# Altium schematic sheet Power_Sheet.SchDoc (part 3 of 3)
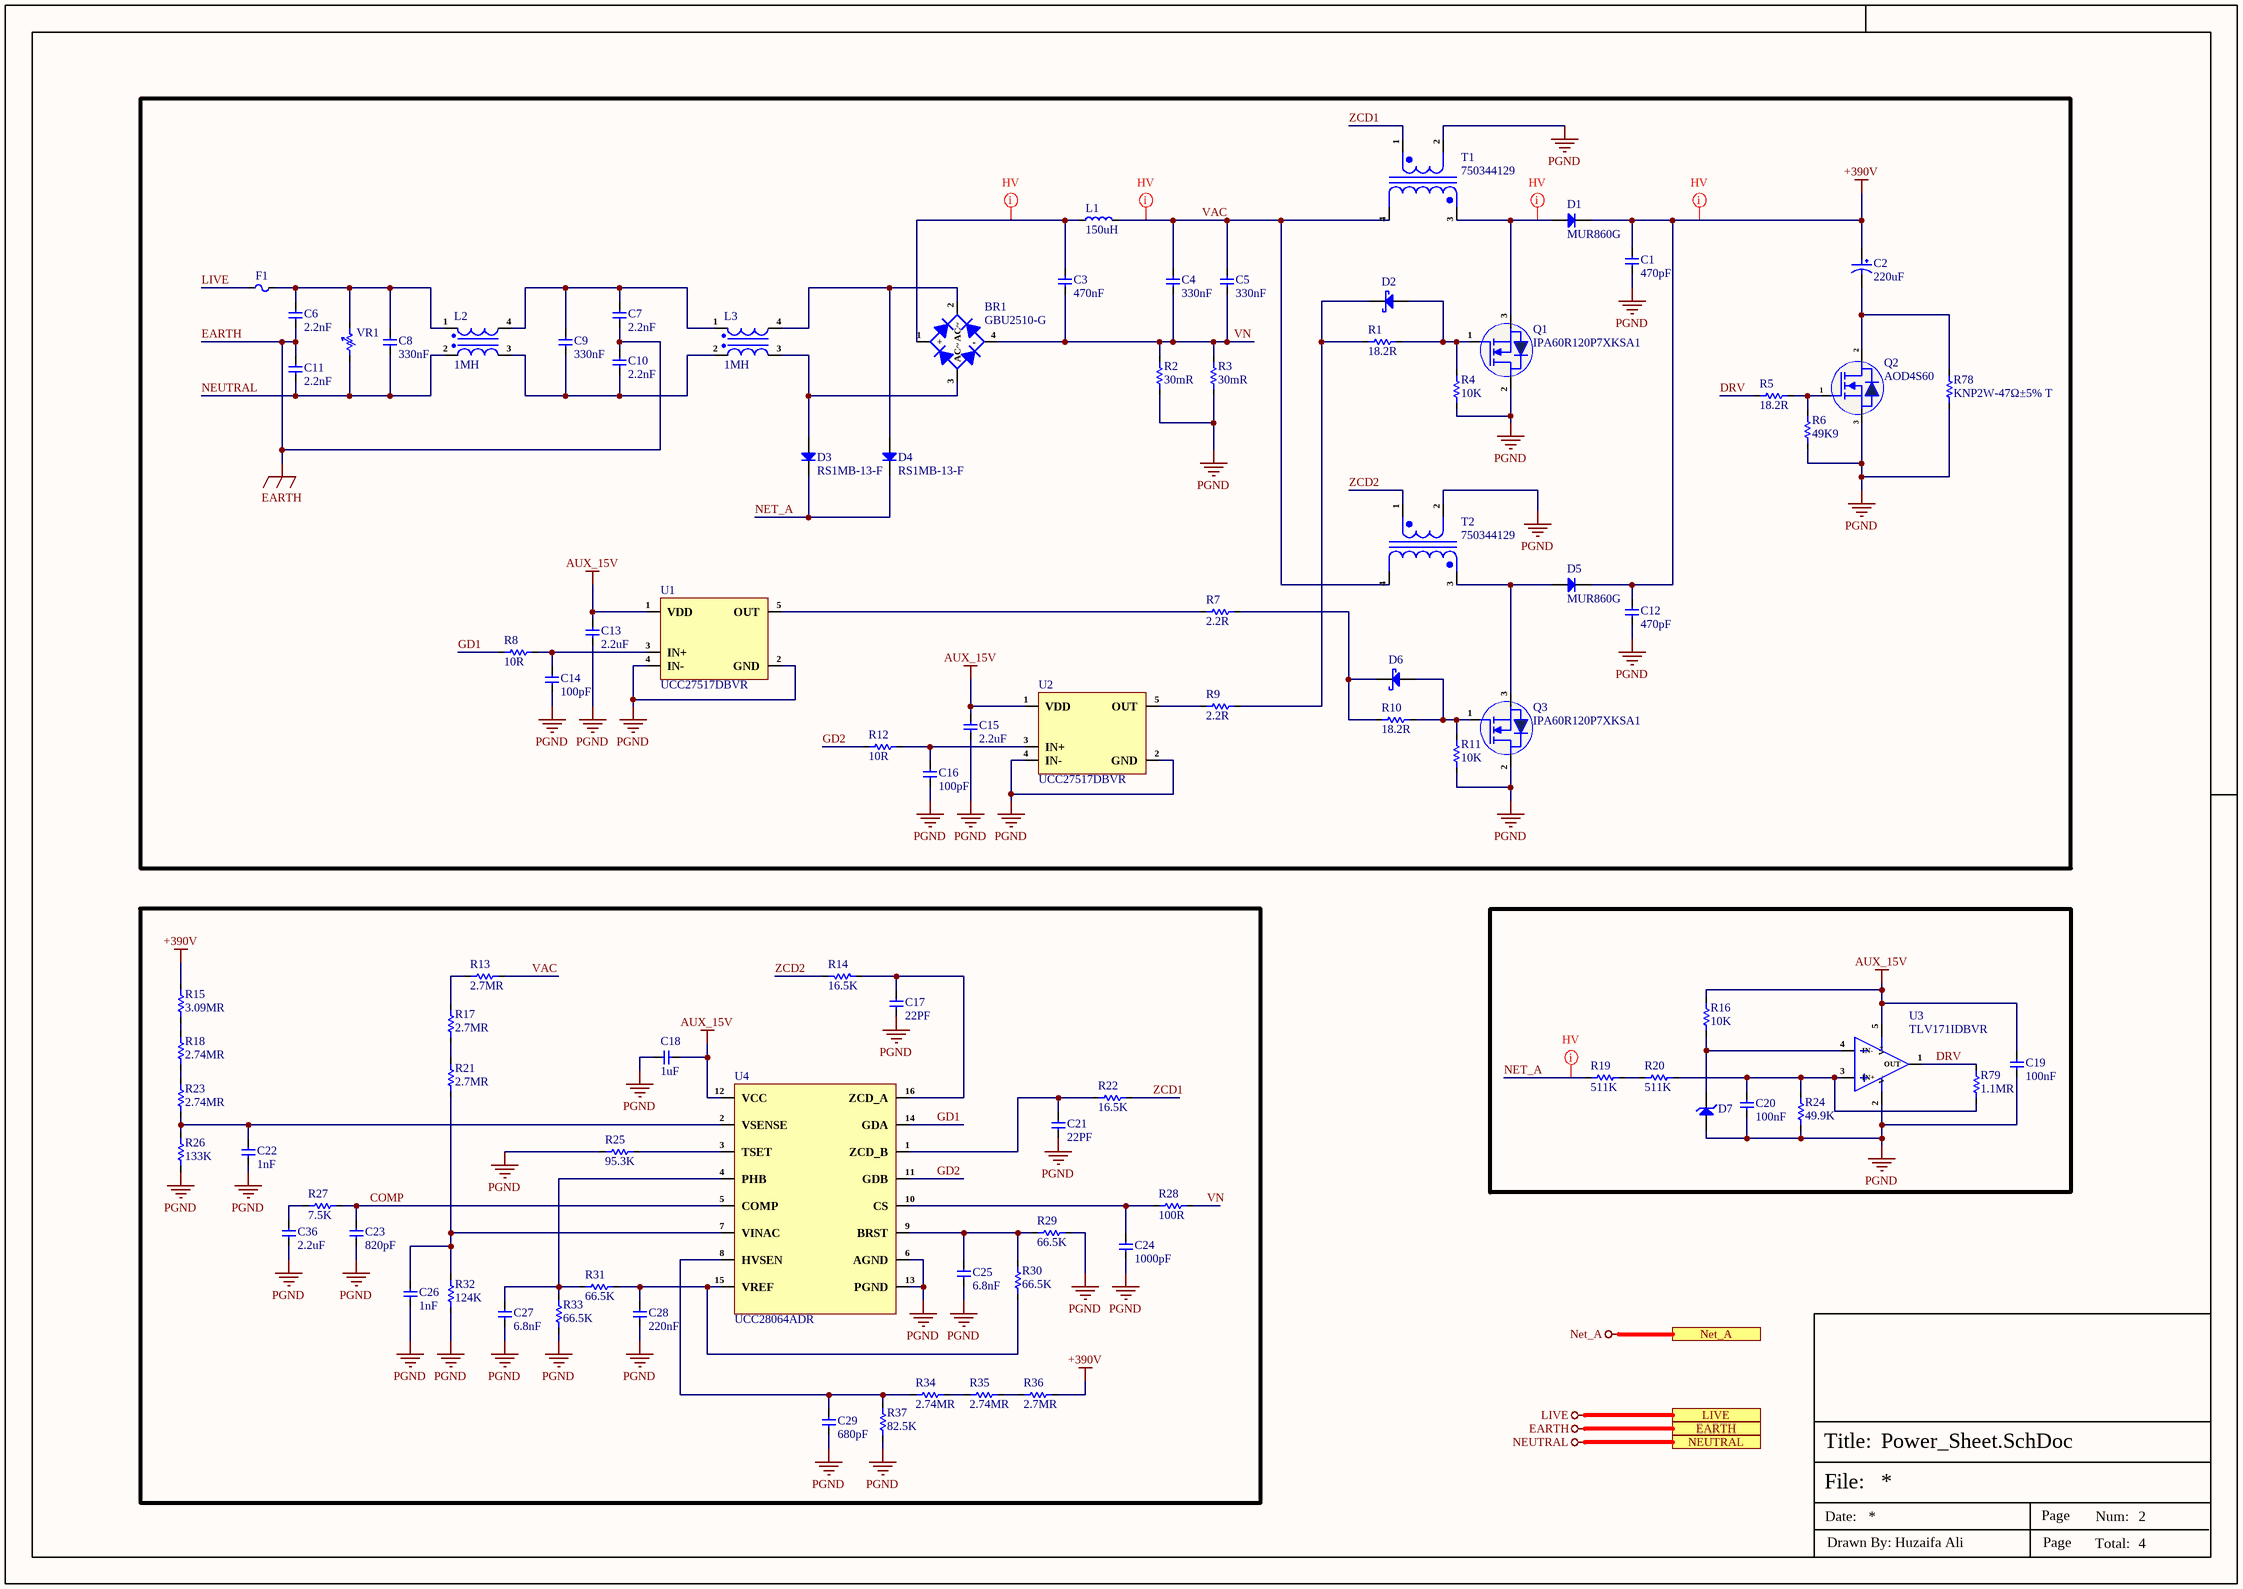
[diagram p2: Power_Sheet.SchDoc]

## Library data of the parts (continued)
R18 R23 R34 R35 = RC0805FR-072M74L: RES 2.74M OHM 1% 1/8W 0805; Manufacturer: Yageo; Item Type: Resistors; Temperature Coefficient: 100ppm/°C; Max Power Dissipation: 125mW; Voltage Rating (DC): 150V; Supplier: Arrow Electronics; LCSC Part Number: C483055; Manufacturer Part Number: RC0805FR-072M74L; RoHS: Yes; Stock: 1449; Pricing: 1=0.0049, 1000=0.0048 (USD); Case/Package: 0805; Contact Plating: Tin,Matte; Case Code (Metric): 2012; Case Code (Imperial): 0805; Min Operating Temperature: -55°C; Max Operating Temperature: 155°C; Value: 2.74MR; Tolerance: 1%; Packaging: Cut Tape; Number of Terminations: 2; Features: Moisture Resistant; Series: RC; Lead Free: Lead Free; RoHS Compliant: Yes; ComponentLink1URL: https://datasheet.ciiva.com/2520/pyu-r-int-thick-7-2520626.pdf?src-supplier=Digikey; ComponentLink1Description: https://datasheet.ciiva.com/2520/pyu-r-int-thick-7-2520626.pdf?src-supplier=Digikey; ComponentLink2URL: https://datasheet.ciiva.com/2520/pyu-r-int-thick-7-2520627.pdf?src-supplier=Digikey; ComponentLink2Description: https://datasheet.ciiva.com/2520/pyu-r-int-thick-7-2520627.pdf?src-supplier=Digikey; ComponentLink3URL: https://datasheet.ciiva.com/2520/pyu-r-int-thick-7-2520628.pdf?src-supplier=Digikey; ComponentLink3Description: https://datasheet.ciiva.com/2520/pyu-r-int-thick-7-2520628.pdf?src-supplier=Digikey
R19 R20 = CR1206F511KP05Z: 250mW Thick Film Resistors 200V ±100ppm/℃ ±1% 511kΩ 1206 Chip Resistor - Surface Mount ROHS; Manufacturer: Ever Ohms Tech; Manufacturer Part Number: CR1206F511KP05Z; Package: 1206; LCSC Part Number: C245565; Item Type: Resistor; ComponentLink1Description: LCSC; ComponentLink1URL: https://www.lcsc.com/product-detail/Chip-Resistor-Surface-Mount_Ever-Ohms-Tech-CR1206F511KP05Z_C245565.html
R24 = RC0805FR-0749K9L: RES 49.9K OHM 1% 1/8W 0805; Manufacturer: Yageo; Item Type: Resistor; Supplier: Future Electronics; Supplier Part Number: 3813284; Manufacturer Part Number: RC0805FR-0749K9L; RoHS: Yes; Category: Chip SMD Resistors; Stock: 665000; Pricing: 5000=0.0041, 25000=0.0025, 50000=0.0038, 125000=0.0024, 200000=0.0036, 500000=0.0023, 625000=0.0035, 1250000=0.0021, 2000000=0.0032 (USD); ComponentLink1URL: https://datasheet.ciiva.com/11808/0900766b8106beab-11808911.pdf?src-supplier=Rs; ComponentLink1Description: https://datasheet.ciiva.com/11808/0900766b8106beab-11808911.pdf?src-supplier=Rs; ComponentLink2URL: https://datasheet.ciiva.com/12656/rc0805-12656764.pdf?src-supplier=Mouser; ComponentLink2Description: https://datasheet.ciiva.com/12656/rc0805-12656764.pdf?src-supplier=Mouser; ComponentLink3URL: https://datasheet.ciiva.com/2456/pyu-r-int-thick-7-2456990.pdf?src-supplier=Digi-Key; ComponentLink3Description: https://datasheet.ciiva.com/2456/pyu-r-int-thick-7-2456990.pdf?src-supplier=Digi-Key; ComponentLink4URL: https://datasheet.ciiva.com/2456/pyu-r-int-thick-7-2456991.pdf?src-supplier=Digi-Key; ComponentLink4Description: https://datasheet.ciiva.com/2456/pyu-r-int-thick-7-2456991.pdf?src-supplier=Digi-Key; ComponentLink5URL: https://datasheet.ciiva.com/2456/pyu-r-int-thick-7-2456992.pdf?src-supplier=Digi-Key; ComponentLink5Description: https://datasheet.ciiva.com/2456/pyu-r-int-thick-7-2456992.pdf?src-supplier=Digi-Key; LCSC Part Number: C114540
R25 = RC0402FR-0795K3L: RES 95.3K OHM 1% 1/16W 0402; Manufacturer: Yageo; Resistance: 95.3kR; Temperature Coefficient: 100ppm/°C; Power Rating: 62.5mW; Voltage Rating: 50V; Max Power Dissipation: 63mW; Item Type: Resistor; Supplier 1: Future Electronics; Manufacturer Part Number: RC0402FR-0795K3L; RoHS: Yes; Category: Chip SMD Resistors; Stock 1: 20000; Pricing 1: 10000=0.00090, 50000=0.00080, 300000=0.00080, 1000000=0.00070, 3000000=0.00070 (USD); Case/Package: 0402; Contact Plating: Tin,Matte; Case Code (Imperial): 0402; Case Code (Metric): 1005; Size Code: 0402; Min Operating Temperature: -55°C; Max Operating Temperature: 155°C; Tolerance: 1%; Resistor Type: Thick Film; Packaging: Tape and Reel; Package Quantity: 1; Termination: SMD/SMT; Number of Terminations: 2; Voltage Rating (DC): 50V; Features: Moisture Resistant; Series: RC; Resistance Tolerance: 1%; Construction: Rectangular; Length: 0.039inch; Width: 0.02inch; Height: 0.016inch; Depth: 0.5mm; Military Standard: Not; Lead Free: Lead Free; RoHS Compliant: Yes; ComponentLink1URL: https://datasheet.ciiva.com/2453/pyu-r-int-thick-7-2453485.pdf?src-supplier=Digi-Key; ComponentLink1Description: https://datasheet.ciiva.com/2453/pyu-r-int-thick-7-2453485.pdf?src-supplier=Digi-Key; ComponentLink2URL: https://datasheet.ciiva.com/2453/pyu-r-int-thick-7-2453486.pdf?src-supplier=Digi-Key; ComponentLink2Description: https://datasheet.ciiva.com/2453/pyu-r-int-thick-7-2453486.pdf?src-supplier=Digi-Key; ComponentLink3URL: https://datasheet.ciiva.com/2453/pyu-r-int-thick-7-2453484.pdf?src-supplier=Digi-Key; ComponentLink3Description: https://datasheet.ciiva.com/2453/pyu-r-int-thick-7-2453484.pdf?src-supplier=Digi-Key; ComponentLink4URL: https://datasheet.ciiva.com/16746/pyu-rc0402-51-rohs-l-6-r-16746015.pdf?src-supplier=Future+Electronics; ComponentLink4Description: https://datasheet.ciiva.com/16746/pyu-rc0402-51-rohs-l-6-r-16746015.pdf?src-supplier=Future+Electronics; Supplier Part Number 1: 8486029; LCSC Part Number: C276280
R26 = 0603WAF1333T5E: 100mW Thick Film Resistors 75V ±100ppm/℃ ±1% 133kΩ 0603 Chip Resistor - Surface Mount ROHS; Manufacturer: UNI-ROYAL; Manufacturer Part Number: 0603WAF1333T5E; Package: 0603; LCSC Part Number: C22870; Item Type: Resistor; ComponentLink1Description: LCSC; ComponentLink1URL: https://www.lcsc.com/product-detail/Chip-Resistor-Surface-Mount_UNI-ROYAL-Uniroyal-Elec-0603WAF1333T5E_C22870.html
R27 = RT0603BRD077K5L: RES SMD 7.5K OHM 0.1% 1/10W 0603; Manufacturer: Yageo; Resistance: 7.5kR; Power Rating: 100mW; Voltage Rating: 75V; Temperature Coefficient: 25ppm/°C; Voltage Rating (DC): 50V; Item Type: Resistor; Supplier 1: Avnet; Manufacturer Part Number: RT0603BRD077K5L; RoHS: Yes; Category: Chip SMD Resistors; Stock 1: 30000; Pricing 1: 5000=0.02327, 10000=0.02294, 20000=0.02227 (USD); Case/Package: 0603; Case Code (Imperial): 0603; Case Code (Metric): 1608; Weight: 7.1E-05oz; Contact Plating: Tin,Matte; Size Code: 0603; Min Operating Temperature: -55°C; Max Operating Temperature: 125°C; Package Quantity: 5000; Packaging: Tape and Reel; Tolerance: 0.1%; Resistor Type: Thin Film; Termination: SMD/SMT; Number of Terminations: 2; Max Power Dissipation: 100mW; Features: Moisture Resistant; Series: RT; Length: 0.063inch; Width: 0.8mm; Height: 0.022inch; Radiation Hardening: No; Lead Free: Lead Free; RoHS Compliant: Yes; ComponentLink1URL: https://datasheet.ciiva.com/8891/pyu-rt-1-to-0-05-rohs-l-4-8891914.pdf?src-supplier=Avnet; ComponentLink1Description: https://datasheet.ciiva.com/8891/pyu-rt-1-to-0-05-rohs-l-4-8891914.pdf?src-supplier=Avnet; Supplier Part Number 1: RT0603BRD077K5L; LCSC Part Number: C728597
R28 = CRCW0603100RFKEB: RES SMD 100 OHM 1% 1/10W 0603; Item Type: Resistor; Power Rating: 100mW; Voltage Rating: 75V; Temperature Coefficient: 100ppm/°C; LCSC Part Number: C844513; ComponentLink1Description: LCSC; Supplier: Mouser; Supplier Part Number: 71-CRCW0603100RFKEB; RoHS: Yes; Category: Chip SMD Resistors; Stock: 43446; Pricing: 1=0.1, 10=0.017, 50=0.017, 100=0.01, 1000=0.008, 10000=0.004 (USD); Case/Package: 0603; Weight: 7.1E-05oz; Case Code (Imperial): 0603; Case Code (Metric): 1608; Contact Plating: Tin; Min Operating Temperature: -55°C; Max Operating Temperature: 155°C; Value: 100R; Tolerance: 1%; Packaging: Tape and Reel; Package Quantity: 10000; Resistor Type: Thick Film; Number of Terminations: 2; Termination: SMD/SMT; Max Power Dissipation: 100mW; Voltage Rating (DC): 75V; Features: Automotive AEC-Q200; Series: CRCW; Resistance Tolerance: 1%; Construction: Rectangular; Length: 1.55mm; Width: 0.85mm; Height: 0.02inch; Depth: 0.85mm; Radiation Hardening: No; RoHS Compliant: Yes; Lead Free: Lead Free; Military Standard: Not; Reach SVHC Compliant: Unknown; ComponentLink2URL: https://datasheet.ciiva.com/28621/1829286-28621369.pdf?src-supplier=Element14; ComponentLink2Description: https://datasheet.ciiva.com/28621/1829286-28621369.pdf?src-supplier=Element14; ComponentLink3URL: https://datasheet.ciiva.com/5551/dcrcwe3-109170-5551614.pdf?src-supplier=Mouser; ComponentLink3Description: https://datasheet.ciiva.com/5551/dcrcwe3-109170-5551614.pdf?src-supplier=Mouser; ComponentLink4URL: https://datasheet.ciiva.com/3256/dcrcwe3-3256927.pdf?src-supplier=Avnet; ComponentLink4Description: https://datasheet.ciiva.com/3256/dcrcwe3-3256927.pdf?src-supplier=Avnet; ComponentLink5URL: https://datasheet.ciiva.com/16430/dcrcwe3-16430044.pdf?src-supplier=Future+Electronics; ComponentLink5Description: https://datasheet.ciiva.com/16430/dcrcwe3-16430044.pdf?src-supplier=Future+Electronics
R29-R31 R33 = FRC0603F6652TS: 100mW Thick Film Resistors 75V ±100ppm/℃ ±1% 66.5kΩ 0603 Chip Resistor - Surface Mount ROHS; Manufacturer: FOJAN; Manufacturer Part Number: FRC0603F6652TS; Package: 0603; LCSC Part Number: C2933250; Item Type: Resistor; ComponentLink1Description: LCSC; ComponentLink1URL: https://www.lcsc.com/product-detail/Chip-Resistor-Surface-Mount_FOJAN-FRC0603F6652TS_C2933250.html
R32 = AC0603FR-07124KL: RES SMD 124K OHM 1% 1/10W 0603; Manufacturer: Yageo; Item Type: Resistor; Supplier: Mouser; Supplier Part Number: 603-AC0603FR-07124KL; Manufacturer Part Number: AC0603FR-07124KL; RoHS: Yes; Category: Chip SMD Resistors; Stock: 7297; Pricing: 1=0.1, 10=0.013, 50=0.013, 100=0.007, 1000=0.006, 10000=0.003 (USD); ComponentLink1URL: http://www.mouser.com/ds/2/447/yageodocoutput-1111992.pdf?src-supplier=Mouser; ComponentLink1Description: http://www.mouser.com/ds/2/447/yageodocoutput-1111992.pdf?src-supplier=Mouser; ComponentLink2URL: http://www.yageo.com/NewPortal/yageodocoutput?fileName=/pdf/R-Chip/PYu-AC_51_RoHS_L_6.pdf&src-supplier=Digi-Key; ComponentLink2Description: http://www.yageo.com/NewPortal/yageodocoutput?fileName=/pdf/R-Chip/PYu-AC_51_RoHS_L_6.pdf&src-supplier=Digi-Key; LCSC Part Number: C227568
R37 = RC0603FR-0782K5L: RES 82.5K OHM 1% 1/10W 0603; Manufacturer: Yageo; Item Type: Resistor; Voltage Rating (DC): 50V; Supplier: Avnet; LCSC Part Number: C185310; Manufacturer Part Number: RC0603FR-0782K5L; RoHS: Yes; Stock: 165000; Pricing: 5000=0.00112 (USD); Lead Free: 5697LeadFree; ComponentLink1URL: https://datasheet.ciiva.com/2519/pyu-r-int-thick-7-2519111.pdf?src-supplier=Digikey; ComponentLink1Description: https://datasheet.ciiva.com/2519/pyu-r-int-thick-7-2519111.pdf?src-supplier=Digikey; ComponentLink2URL: https://datasheet.ciiva.com/2519/pyu-r-int-thick-7-2519112.pdf?src-supplier=Digikey; ComponentLink2Description: https://datasheet.ciiva.com/2519/pyu-r-int-thick-7-2519112.pdf?src-supplier=Digikey; ComponentLink3URL: https://datasheet.ciiva.com/2519/pyu-r-int-thick-7-2519113.pdf?src-supplier=Digikey; ComponentLink3Description: https://datasheet.ciiva.com/2519/pyu-r-int-thick-7-2519113.pdf?src-supplier=Digikey
R78 = 1/4 watt Resistor: Wirewound Resistors 47Ω 2W ±350ppm/℃ ±5% Plugin,D5xL15.5mm Through Hole Resistors ROHS; Manufacturer: CCO(Chian Chia Elec); Manufacturer Part Number: KNP2W-47Ω±5% T; LCSC Part Number: C122138; Item Type: Resistor
R79 = 0603WAF1104T5E: 100mW Thick Film Resistors 75V ±100ppm/℃ ±1% 1.1MΩ 0603 Chip Resistor - Surface Mount ROHS; Manufacturer: Uniroyal; Supplier: LCSC; LCSC Part Number: C13314; Manufacturer Part Number: 0603WAF1104T5E; RoHS: No; Item Type: Resistor
T1 T2 = 750344129: Manufacturer: Wurth Electronik; Manufacturer Part Number: 750344127; Item Type: Transformer; Package: THT
U1 U2 = UCC27517DBVR: IC GATE DRVR LOW-SIDE SOT23-5; Manufacturer: Texas Instruments; Operating Supply Voltage: 12V; Number of Outputs: 1; Max Supply Voltage: 18V; Min Supply Voltage: 4.5V; Rise Time: 22ns; Propagation Delay: 30ns; Output Current: 4A; Channel Type: Single; Fall Time: 11ns; Supplier: Mouser; LCSC Part Number: C99395; Manufacturer Part Number: UCC27517DBVR; RoHS: Yes; Item Type: IC; Stock: 71094; Pricing: 1=0.77, 10=0.646, 50=0.646, 100=0.501, 1000=0.346, 10000=0.29 (USD); Mounting Technology: Surface Mount; Case/Package: SOT-23-5; Pins: 5; Min Operating Temperature: -40°C; Max Operating Temperature: 140°C; Packaging: Tape and Reel; Package Quantity: 3000; Max Output current: 4A; Number of Drivers: 1; Turn-On Delay Time: 30ns; Number of Channels: 1; Series: -; Length: 2.9mm; Width: 1.6mm; Height: 1.45mm; Thickness: 1.2mm; Radiation Hardening: No; Lead Free: Lead Free; RoHS Compliant: Yes; ComponentLink1URL: http://components.arrow.com/part/dataview/52526194S5756N7713?src-supplier=Arrow+Electronics; ComponentLink1Description: http://components.arrow.com/part/dataview/52526194S5756N7713?src-supplier=Arrow+Electronics; ComponentLink2URL: http://www.ti.com/lit/ds/symlink/ucc27517.pdf?src-supplier=Avnet; ComponentLink2Description: http://www.ti.com/lit/ds/symlink/ucc27517.pdf?src-supplier=Avnet; ComponentLink3URL: http://www.ti.com/lit/ds/symlink/ucc27517.pdf?src-supplier=Digikey; ComponentLink3Description: http://www.ti.com/lit/ds/symlink/ucc27517.pdf?src-supplier=Digikey; ComponentLink4URL: http://www.ti.com/lit/gpn/ucc27517?src-supplier=Mouser; ComponentLink4Description: http://www.ti.com/lit/gpn/ucc27517?src-supplier=Mouser; ComponentLink5URL: http://www.ti.com/general/docs/lit/getliterature.tsp?genericPartNumber=UCC27516&&fileType=pdf&src-supplier=Avnet; ComponentLink5Description: http://www.ti.com/general/docs/lit/getliterature.tsp?genericPartNumber=UCC27516&&fileType=pdf&src-supplier=Avnet; ComponentLink6URL: https://www.verical.com/server-webapp/html/getDatasheet?partID=482756&src-supplier=Verical; ComponentLink6Description: https://www.verical.com/server-webapp/html/getDatasheet?partID=482756&src-supplier=Verical
U3 = TLV171IDBVR: IC OPAMP GP 1 CIRCUIT SOT23-5; Manufacturer: Texas Instruments; Supplier: Mouser; LCSC Part Number: C2864299; Manufacturer Part Number: TLV171IDBVR; RoHS: Yes; Item Type: IC; Stock: 79952; Pricing: 1=1.26, 10=1.09, 50=1.09, 100=0.829, 1000=0.578, 10000=0.478 (USD); ComponentLink1URL: http://www.ti.com/lit/ds/symlink/tlv171.pdf?src-supplier=Digikey; ComponentLink1Description: http://www.ti.com/lit/ds/symlink/tlv171.pdf?src-supplier=Digikey; ComponentLink2URL: http://www.ti.com/general/docs/suppproductinfo.tsp?distId=10&amp;gotoUrl=http%3A%2F%2Fwww.ti.com%2Flit%2Fgpn%2Ftlv171&src-supplier=Digikey; ComponentLink2Description: http://www.ti.com/general/docs/suppproductinfo.tsp?distId=10&amp;gotoUrl=http%3A%2F%2Fwww.ti.com%2Flit%2Fgpn%2Ftlv171&src-supplier=Digikey
U4 = UCC28064ADR: IC PFC CTR TRANS 45KHZ 16SOIC; Manufacturer: Texas Instruments; Supplier: Mouser; LCSC Part Number: C882391; Manufacturer Part Number: UCC28064ADR; RoHS: Yes; Item Type: IC; Stock: 4170; Pricing: 1=2.39, 10=2.15, 50=2.15, 100=1.73, 1000=1.17, 10000=1 (USD); ComponentLink1URL: http://www.ti.com/general/docs/suppproductinfo.tsp?distId=10&amp;gotoUrl=http%3A%2F%2Fwww.ti.com%2Flit%2Fgpn%2Fucc28064a&src-supplier=Digikey; ComponentLink1Description: http://www.ti.com/general/docs/suppproductinfo.tsp?distId=10&amp;gotoUrl=http%3A%2F%2Fwww.ti.com%2Flit%2Fgpn%2Fucc28064a&src-supplier=Digikey
VR1 = B72210S2271K101: VARISTOR 430V 3.5KA DISC 10MM; Manufacturer: TDK EPCOS; Item Type: Varistors; Value: 195pF; Number of Circuits: 1; Max Voltage Rating (AC): 275V; Max Voltage Rating (DC): 350V; Energy: 55J; Min Varistor Voltage: 387V; Max Varistor Voltage: 473V; Clamping Current: 25A; Clamping Voltage: 710V; Lead/Base Style: Radial; Voltage Tolerance: 10%; Power Rating: 400mW; ESD Protection: 5898YesNo; Supplier: Avnet; LCSC Part Number: C210564; Manufacturer Part Number: B72210S2271K101; RoHS: Yes; Stock: 5700; Pricing: 1=0.12365, 10=0.12192, 30=0.12018, 50=0.11845, 100=0.11671 (USD); Mounting Technology: Through Hole; Case/Package: Radial; Contact Plating: 154ConductorMaterial; Weight: 2.000002g; Material: 4240ConductorMaterial; Min Operating Temperature: -40°C; Max Operating Temperature: 85°C; Packaging: Bulk; Varistor Voltage: 430V; Max Surge Current: 3.5kA; Series: AdvanceD; Voltage Rating: 350V; Voltage Rating (AC): 275V; Voltage Rating (DC): 350V; Termination: 4745ConnectorType; Tolerance: 10%; Current Rating: 25A; Diameter: 12mm; Height: 14.5mm; Lead Pitch: 7.5mm; Depth: 5.4mm; Radiation Hardening: 5898YesNo; RoHS Compliant: Yes; Reach SVHC Compliant: Unknown; Flammability Rating: 5813Flammability; ComponentLink1URL: http://www.farnell.com/datasheets/1680955.pdf?src-supplier=Farnell; ComponentLink1Description: http://www.farnell.com/datasheets/1680955.pdf?src-supplier=Farnell; ComponentLink2URL: http://www.farnell.com/datasheets/2311597.pdf?src-supplier=Farnell; ComponentLink2Description: http://www.farnell.com/datasheets/2311597.pdf?src-supplier=Farnell; ComponentLink3URL: http://components.arrow.com/part/dataview/30869957S9461734N9769?src-supplier=Arrow+Electronics; ComponentLink3Description: http://components.arrow.com/part/dataview/30869957S9461734N9769?src-supplier=Arrow+Electronics; ComponentLink4URL: http://www.farnell.com/datasheets/1680955.pdf?src-supplier=Element14; ComponentLink4Description: http://www.farnell.com/datasheets/1680955.pdf?src-supplier=Element14; ComponentLink5URL: http://www.farnell.com/datasheets/2311597.pdf?src-supplier=Newark; ComponentLink5Description: http://www.farnell.com/datasheets/2311597.pdf?src-supplier=Newark; ComponentLink6URL: http://datasheet.octopart.com/B72210S2271K101-EPCOS-datasheet-11546246.pdf?src-supplier=Distrelec; ComponentLink6Description: http://datasheet.octopart.com/B72210S2271K101-EPCOS-datasheet-11546246.pdf?src-supplier=Distrelec; ComponentLink7URL: https://en.tdk.eu/inf/70/db/var/SIOV_Leaded_AdvanceD.pdf?src-supplier=Digikey; ComponentLink7Description: https://en.tdk.eu/inf/70/db/var/SIOV_Leaded_AdvanceD.pdf?src-supplier=Digikey; ComponentLink8URL: https://datasheet.octopart.com/S10K275E2-EPCOS-datasheet-5104.pdf?src-supplier=Future+Electronics; ComponentLink8Description: https://datasheet.octopart.com/S10K275E2-EPCOS-datasheet-5104.pdf?src-supplier=Future+Electronics; ComponentLink9URL: http://datasheet.octopart.com/B72210S2271K101-EPCOS-datasheet-11546246.pdf?src-supplier=Mouser; ComponentLink9Description: http://datasheet.octopart.com/B72210S2271K101-EPCOS-datasheet-11546246.pdf?src-supplier=Mouser; ComponentLink10URL: https://datasheet.octopart.com/B72210S2271K101-EPCOS-datasheet-11546246.pdf?src-supplier=Newark; ComponentLink10Description: https://datasheet.octopart.com/B72210S2271K101-EPCOS-datasheet-11546246.pdf?src-supplier=Newark; ComponentLink11URL: http://datasheet.octopart.com/B72210S2271K101-EPCOS-datasheet-11546246.pdf?src-supplier=Avnet; ComponentLink11Description: http://datasheet.octopart.com/B72210S2271K101-EPCOS-datasheet-11546246.pdf?src-supplier=Avnet; ComponentLink12URL: http://www.epcos.com/inf/70/db/var_08/SIOV_Leaded_StandarD.pdf?src-supplier=Future+Electronics; ComponentLink12Description: http://www.epcos.com/inf/70/db/var_08/SIOV_Leaded_StandarD.pdf?src-supplier=Future+Electronics; ComponentLink13URL: http://datasheet.octopart.com/B72210S2271K101-EPCOS-datasheet-11546246.pdf?src-supplier=Verical; ComponentLink13Description: http://datasheet.octopart.com/B72210S2271K101-EPCOS-datasheet-11546246.pdf?src-supplier=Verical; ComponentLink14URL: http://datasheet.octopart.com/B72210S2271K101-EPCOS-datasheet-11546246.pdf?src-supplier=TME; ComponentLink14Description: http://datasheet.octopart.com/B72210S2271K101-EPCOS-datasheet-11546246.pdf?src-supplier=TME; ComponentLink15URL: http://datasheet.octopart.com/B72210S2271K101-EPCOS-datasheet-11546246.pdf?src-supplier=TTI; ComponentLink15Description: http://datasheet.octopart.com/B72210S2271K101-EPCOS-datasheet-11546246.pdf?src-supplier=TTI; ComponentLink16URL: http://datasheet.octopart.com/B72210S2271K101-EPCOS-datasheet-11546246.pdf?src-supplier=Rutronik; ComponentLink16Description: http://datasheet.octopart.com/B72210S2271K101-EPCOS-datasheet-11546246.pdf?src-supplier=Rutronik